# Altium schematic sheet CRAM_Mk1.SchDoc
size A3; SheetNumber: 1; SheetTotal: 2
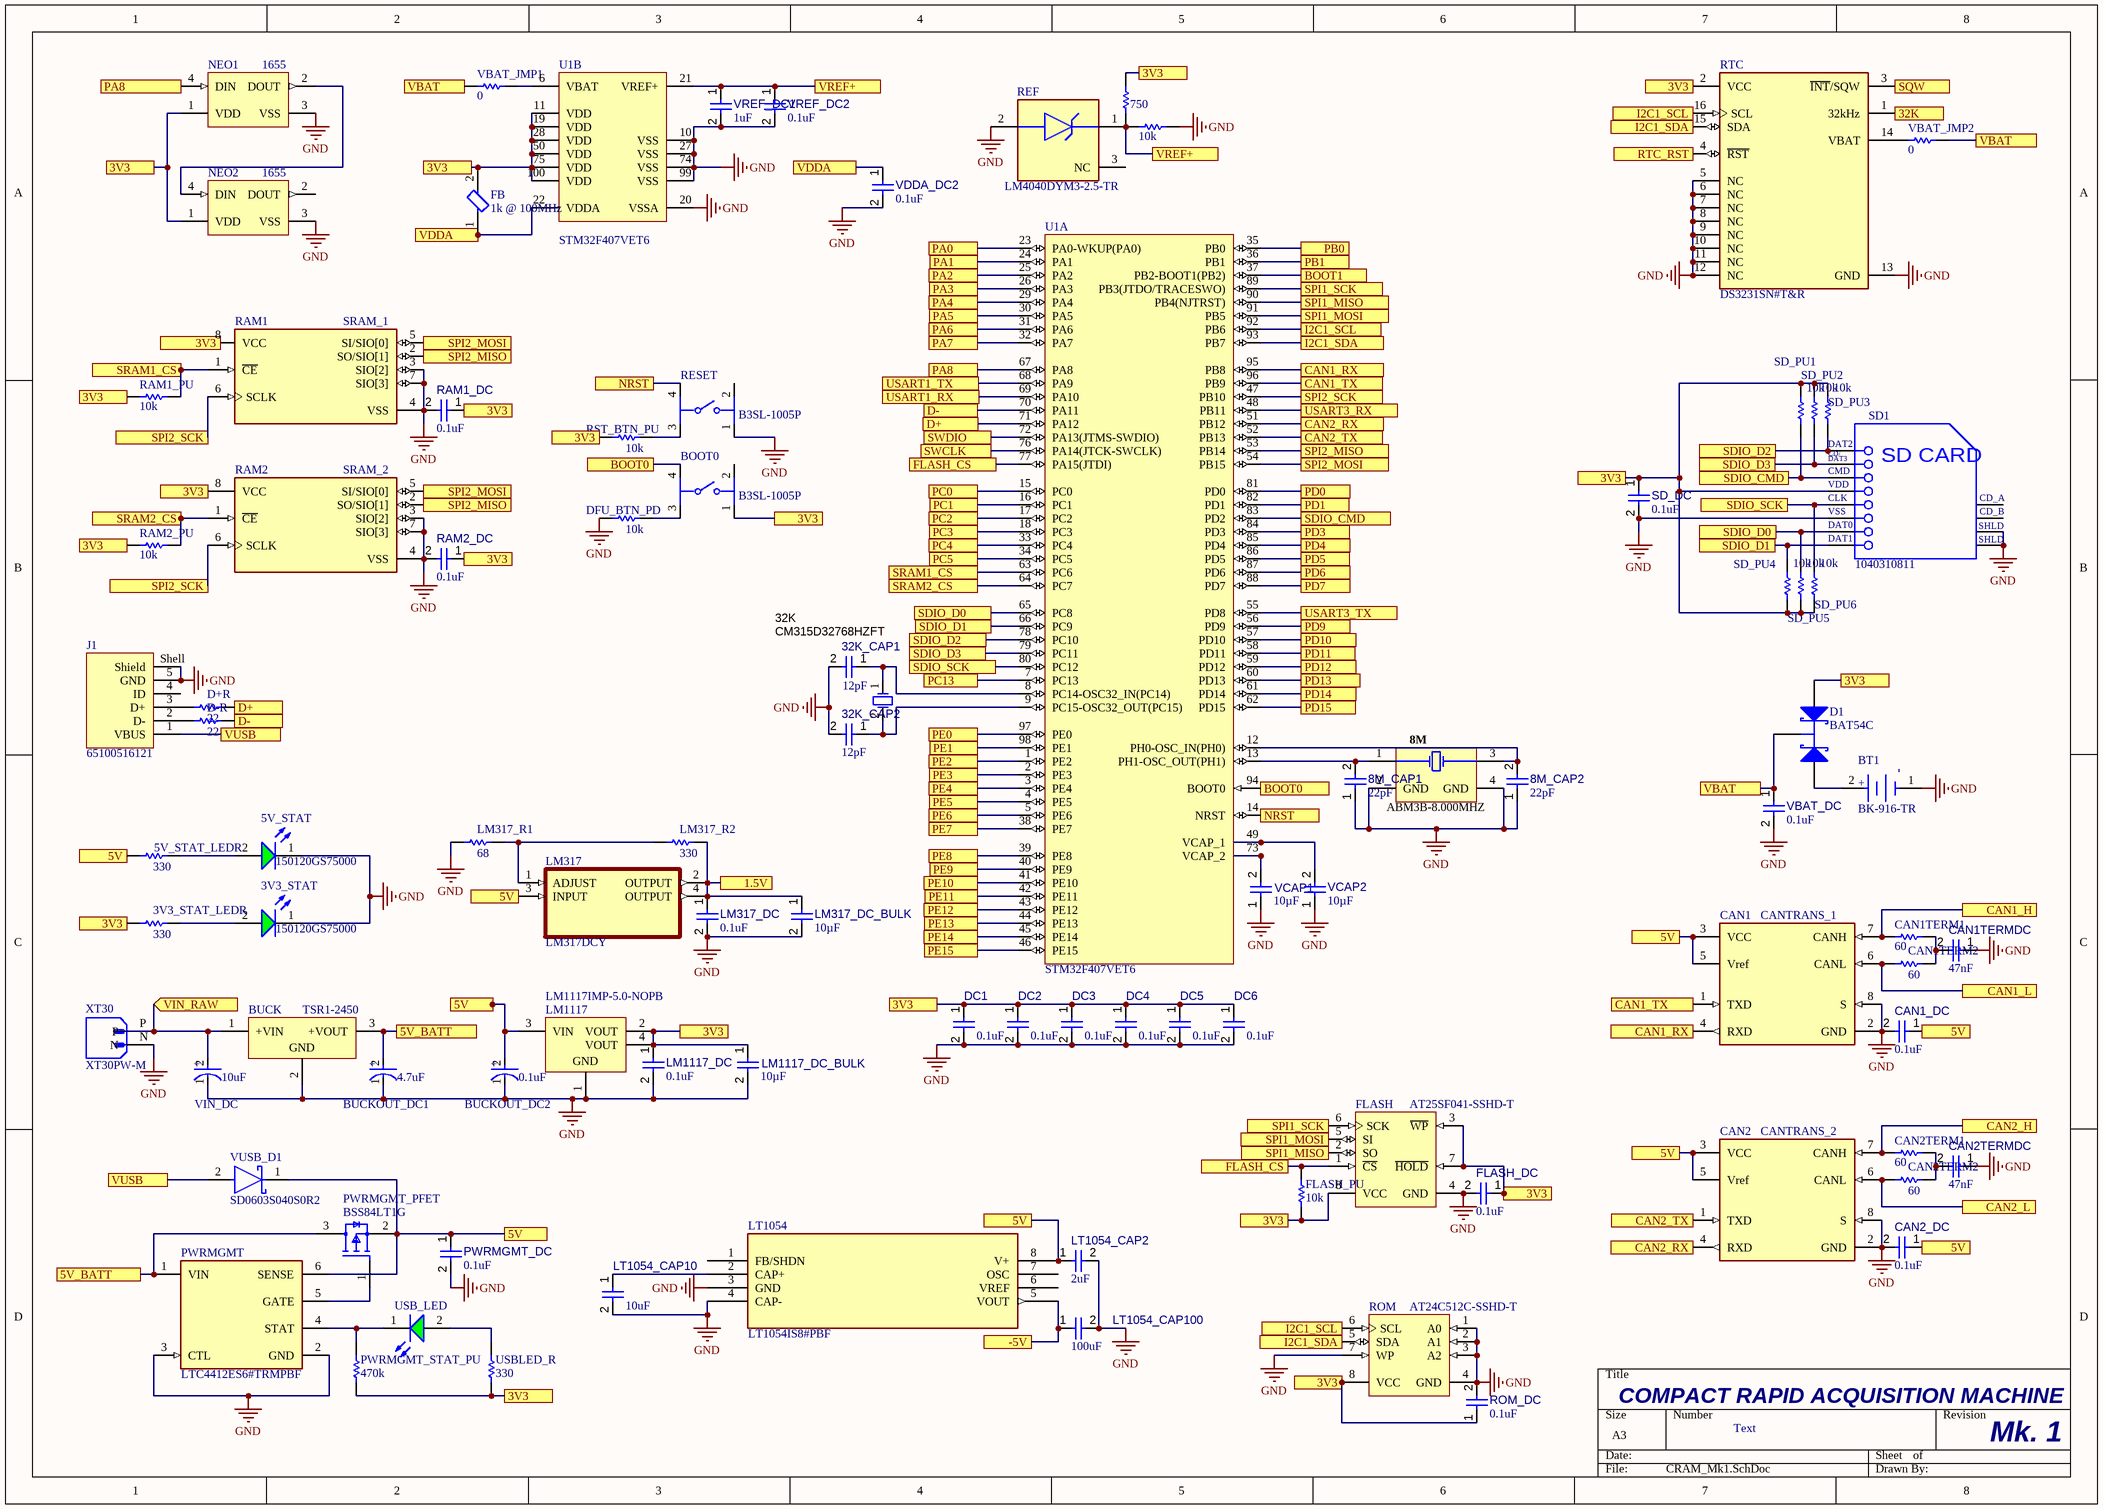
[diagram p0: CRAM_Mk1.SchDoc]

## Parts
3V3_STAT  150120GS75000  [WL-SMCW_1206_150120xx75000]
3V3_STAT_LEDR  value 330  [RESC1608X55X25ML10T15]  (hidden comment: Resistor 0R +/- 5% 0603 100 mW)
5V_STAT  150120GS75000  [WL-SMCW_1206_150120xx75000]
5V_STAT_LEDR  value 330  [RESC1608X55X25ML10T15]  (hidden comment: Resistor 0R +/- 5% 0603 100 mW)
8M  ABM3B-8.000MHZ  [ABRA-ABM3B_V]
8M_CAP1  value 22pF  [CAPC0603(1608)100_L]  (hidden comment: Capacitor 10µF +/-20% 10V 0603)
8M_CAP2  value 22pF  [CAPC0603(1608)100_L]  (hidden comment: Capacitor 10µF +/-20% 10V 0603)
32K  CM315D32768HZFT  [ABRA-ABS07-2_V]
32K_CAP1  value 12pF  [CAPC0603(1608)100_L]  (hidden comment: Capacitor 10µF +/-20% 10V 0603)
32K_CAP2  value 12pF  [CAPC0603(1608)100_L]  (hidden comment: Capacitor 10µF +/-20% 10V 0603)
BOOT0  B3SL-1005P  [FP-B3SL-1005P-MFG]
BT1  BK-916-TR  [FP-BK-916-TR-MFG]
BUCK  TSR1-2450  [TRACO-SIP-3_V]
BUCKOUT_DC1  4.7uF  [FP-FKC-MFG]
BUCKOUT_DC2  0.1uF  [FP-FKC-MFG]
CAN1  CANTRANS_1  [FP-SOT96-1-IPC_A]
CAN1_DC  value 0.1uF  [CAPC0603(1608)100_L]  (hidden comment: Capacitor 10µF +/-20% 10V 0603)
CAN1TERM1  value 60  [RESC1608X55X25ML10T15]  (hidden comment: Resistor 0R +/- 5% 0603 100 mW)
CAN1TERM2  value 60  [RESC1608X55X25ML10T15]  (hidden comment: Resistor 0R +/- 5% 0603 100 mW)
CAN1TERMDC  value 47nF  [CAPC0603(1608)100_L]  (hidden comment: Capacitor 10µF +/-20% 10V 0603)
CAN2  CANTRANS_2  [FP-SOT96-1-IPC_A]
CAN2_DC  value 0.1uF  [CAPC0603(1608)100_L]  (hidden comment: Capacitor 10µF +/-20% 10V 0603)
CAN2TERM1  value 60  [RESC1608X55X25ML10T15]  (hidden comment: Resistor 0R +/- 5% 0603 100 mW)
CAN2TERM2  value 60  [RESC1608X55X25ML10T15]  (hidden comment: Resistor 0R +/- 5% 0603 100 mW)
CAN2TERMDC  value 47nF  [CAPC0603(1608)100_L]  (hidden comment: Capacitor 10µF +/-20% 10V 0603)
D1  BAT54C  [NXP-SOT23-3_V]
D+R  value 22  [RESC1608X55X25ML10T15]  (hidden comment: Resistor 0R +/- 5% 0603 100 mW)
D-R  value 22  [RESC1608X55X25ML10T15]  (hidden comment: Resistor 0R +/- 5% 0603 100 mW)
DC1  value 0.1uF  [CAPC0603(1608)100_L]  (hidden comment: Capacitor 10µF +/-20% 10V 0603)
DC2  value 0.1uF  [CAPC0603(1608)100_L]  (hidden comment: Capacitor 10µF +/-20% 10V 0603)
DC3  value 0.1uF  [CAPC0603(1608)100_L]  (hidden comment: Capacitor 10µF +/-20% 10V 0603)
DC4  value 0.1uF  [CAPC0603(1608)100_L]  (hidden comment: Capacitor 10µF +/-20% 10V 0603)
DC5  value 0.1uF  [CAPC0603(1608)100_L]  (hidden comment: Capacitor 10µF +/-20% 10V 0603)
DC6  value 0.1uF  [CAPC0603(1608)100_L]  (hidden comment: Capacitor 10µF +/-20% 10V 0603)
DFU_BTN_PD  value 10k  [RESC1608X55X25ML10T15]  (hidden comment: Resistor 0R +/- 5% 0603 100 mW)
FB  1k @ 100MHz  [FP-MPZ1608-0_8-IPC_C]
FLASH  AT25SF041-SSHD-T  [ADST-SOIC-8_L]
FLASH_DC  value 0.1uF  [CAPC0603(1608)100_L]  (hidden comment: Capacitor 10µF +/-20% 10V 0603)
FLASH_PU  value 10k  [RESC1608X55X25ML10T15]  (hidden comment: Resistor 0R +/- 5% 0603 100 mW)
J1  65100516121  [65100516121]
LM317  LM317DCY  [SOT230P700X180-4N]
LM317_DC  value 0.1uF  [CAPC0603(1608)100_L]  (hidden comment: Capacitor 10µF +/-20% 10V 0603)
LM317_DC_BULK  value 10µF  [CAPC0603(1608)100_L]  (hidden comment: Capacitor 10µF +/-20% 10V 0603)
LM317_R1  value 68  [RESC2013X60X35ML10T20]  (hidden comment: Resistor 0R +/- 5% 0805 125 mW)
LM317_R2  value 330  [RESC2013X60X35ML10T20]  (hidden comment: Resistor 0R +/- 5% 0805 125 mW)
LM1117  LM1117IMP-5.0-NOPB  [DCY0004A_M]
LM1117_DC  value 0.1uF  [CAPC0603(1608)100_L]  (hidden comment: Capacitor 10µF +/-20% 10V 0603)
LM1117_DC_BULK  value 10µF  [CAPC0603(1608)100_L]  (hidden comment: Capacitor 10µF +/-20% 10V 0603)
LT1054  LT1054IS8#PBF  [SO-8_S]
LT1054_CAP2  value 2uF  [CAPC0603(1608)100_L]  (hidden comment: Capacitor 10µF +/-20% 10V 0603)
LT1054_CAP10  value 10uF  [CAPC0603(1608)100_L]  (hidden comment: Capacitor 10µF +/-20% 10V 0603)
LT1054_CAP100  value 100uF  [CAPC0603(1608)100_L]  (hidden comment: Capacitor 10µF +/-20% 10V 0603)
NEO1  1655  [ADA-RGB-1655_V]
NEO2  1655  [ADA-RGB-1655_V]
PWRMGMT  LTC4412ES6#TRMPBF  [FP-S6-6-05-08-1636-IPC_C]
PWRMGMT_DC  value 0.1uF  [CAPC0603(1608)100_L]  (hidden comment: Capacitor 10µF +/-20% 10V 0603)
PWRMGMT_PFET  BSS84LT1G  [FP-318-08-IPC_A]
PWRMGMT_STAT_PU  value 470k  [RESC1608X55X25ML10T15]  (hidden comment: Resistor 0R +/- 5% 0603 100 mW)
RAM1  SRAM_1  [FP-4677-IPC_C]
RAM1_DC  value 0.1uF  [CAPC0603(1608)100_L]  (hidden comment: Capacitor 10µF +/-20% 10V 0603)
RAM1_PU  value 10k  [RESC1608X55X25ML10T15]  (hidden comment: Resistor 0R +/- 5% 0603 100 mW)
RAM2  SRAM_2  [FP-4677-IPC_C]
RAM2_DC  value 0.1uF  [CAPC0603(1608)100_L]  (hidden comment: Capacitor 10µF +/-20% 10V 0603)
RAM2_PU  value 10k  [RESC1608X55X25ML10T15]  (hidden comment: Resistor 0R +/- 5% 0603 100 mW)
REF  LM4040DYM3-2.5-TR  [FP-SOT23-3LD-PL-1-MFG]
REF_BR1  value 750  [RESC1608X55X25ML10T15]  (hidden comment: Resistor 0R +/- 5% 0603 100 mW)
REF_BR2  value 10k  [RESC1608X55X25ML10T15]  (hidden comment: Resistor 0R +/- 5% 0603 100 mW)
RESET  B3SL-1005P  [FP-B3SL-1005P-MFG]
ROM  AT24C512C-SSHD-T  [ATML-8S1_L]
ROM_DC  value 0.1uF  [CAPC0603(1608)100_L]  (hidden comment: Capacitor 10µF +/-20% 10V 0603)
RST_BTN_PU  value 10k  [RESC1608X55X25ML10T15]  (hidden comment: Resistor 0R +/- 5% 0603 100 mW)
RTC  DS3231SN#T&R  [FP-W16-H2-MFG]
SD1  1040310811  [MOLX-104031-0811_V]
SD_DC  value 0.1uF  [CAPC0603(1608)100_L]  (hidden comment: Capacitor 10µF +/-20% 10V 0603)
SD_PU1  value 10k  [RESC1608X55X25ML10T15]  (hidden comment: Resistor 0R +/- 5% 0603 100 mW)
SD_PU2  value 10k  [RESC1608X55X25ML10T15]  (hidden comment: Resistor 0R +/- 5% 0603 100 mW)
SD_PU3  value 10k  [RESC1608X55X25ML10T15]  (hidden comment: Resistor 0R +/- 5% 0603 100 mW)
SD_PU4  value 10k  [RESC1608X55X25ML10T15]  (hidden comment: Resistor 0R +/- 5% 0603 100 mW)
SD_PU5  value 10k  [RESC1608X55X25ML10T15]  (hidden comment: Resistor 0R +/- 5% 0603 100 mW)
SD_PU6  value 10k  [RESC1608X55X25ML10T15]  (hidden comment: Resistor 0R +/- 5% 0603 100 mW)
U1  STM32F407VET6  [STM-LQFP100_L]  (parts A,B of 2)
USB_LED  150120GS75000  [WL-SMCW_1206_150120xx75000]  (value not drawn)
USBLED_R  value 330  [RESC1608X55X25ML10T15]  (hidden comment: Resistor 0R +/- 5% 0603 100 mW)
VBAT_DC  value 0.1uF  [CAPC0603(1608)100_L]  (hidden comment: Capacitor 10µF +/-20% 10V 0603)
VBAT_JMP1  value 0  [RESC1608X55X25ML10T15]  (hidden comment: Resistor 0R +/- 5% 0603 100 mW)
VBAT_JMP2  value 0  [RESC1608X55X25ML10T15]  (hidden comment: Resistor 0R +/- 5% 0603 100 mW)
VCAP1  value 10µF  [CAPC0603(1608)100_L]  (hidden comment: Capacitor 10µF +/-20% 10V 0603)
VCAP2  value 10µF  [CAPC0603(1608)100_L]  (hidden comment: Capacitor 10µF +/-20% 10V 0603)
VDDA_DC2  value 0.1uF  [CAPC0603(1608)100_L]  (hidden comment: Capacitor 10µF +/-20% 10V 0603)
VIN_DC  10uF  [FP-FKC-MFG]
VREF_DC1  value 1uF  [CAPC0603(1608)100_L]  (hidden comment: Capacitor 10µF +/-20% 10V 0603)
VREF_DC2  value 0.1uF  [CAPC0603(1608)100_L]  (hidden comment: Capacitor 10µF +/-20% 10V 0603)
VUSB_D1  SD0603S040S0R2  [FP-SD0603-MFG]
XT30  XT30PW-M  [AMASS_XT30PW-M]

## Ports
1.5V, 3V3, 5V, 5V_BATT, 32K, -5V, BOOT0, BOOT1, CAN1_H, CAN1_L, CAN1_RX, CAN1_TX, CAN2_H, CAN2_L, CAN2_RX, CAN2_TX, D+, D-, FLASH_CS, I2C1_SCL, I2C1_SDA, NRST, PA0, PA1, PA2, PA3, PA4, PA5, PA6, PA7, PA8, PB0, PB1, PC0, PC1, PC2, PC3, PC4, PC5, PC13, PD0, PD1, PD3, PD4, PD5, PD6, PD7, PD9, PD10, PD11, PD12, PD13, PD14, PD15, PE0, PE1, PE2, PE3, PE4, PE5, PE6, PE7, PE8, PE9, PE10, PE11, PE12, PE13, PE14, PE15, RTC_RST, SDIO_CMD, SDIO_D0, SDIO_D1, SDIO_D2, SDIO_D3, SDIO_SCK, SPI1_MISO, SPI1_MOSI, SPI1_SCK, SPI2_MISO, SPI2_MOSI, SPI2_SCK, SQW, SRAM1_CS, SRAM2_CS, SWCLK, SWDIO, USART1_RX, USART1_TX, USART3_RX, USART3_TX, VBAT, VDDA, VIN_RAW (in), VREF+, VUSB

## Nets
GND: 3V3_STAT.1(K) 5V_STAT.1(K) 8M.2(GND) 8M.4(GND) 8M_CAP1.1 8M_CAP2.1 32K_CAP1.2 32K_CAP2.2 BT1.1(C) BUCK.2(GND) BUCKOUT_DC1.1(C) BUCKOUT_DC2.1(C) CAN1.2(GND) CAN1.8(S) CAN1_DC.2 CAN1TERMDC.1 CAN2.2(GND) CAN2.8(S) CAN2_DC.2 CAN2TERMDC.1 DC1.2 DC2.2 DC3.2 DC4.2 DC5.2 DC6.2 DFU_BTN_PD.1 FLASH.4(GND) FLASH_DC.2 J1.5(GND) J1.Shell(Shield) LM317_DC.2 LM317_DC_BULK.2 LM317_R1.1 LM1117.1(GND) LM1117_DC.2 LM1117_DC_BULK.2 LT1054.3(GND) LT1054.4(CAP-) LT1054_CAP2.2 LT1054_CAP10.2 LT1054_CAP100.2 NEO1.3(VSS) NEO2.3(VSS) PWRMGMT.2(GND) PWRMGMT.3(CTL) PWRMGMT_DC.2 RAM1.3(SIO[2]) RAM1.4(VSS) RAM1.7(SIO[3]) RAM1_DC.2 RAM2.3(SIO[2]) RAM2.4(VSS) RAM2.7(SIO[3]) RAM2_DC.2 REF.2(-) REF_BR2.1 RESET.1 ROM.1(A0) ROM.2(A1) ROM.3(A2) ROM.4(GND) ROM.7(WP) ROM_DC.2 RTC.5(NC) RTC.6(NC) RTC.7(NC) RTC.8(NC) RTC.9(NC) RTC.10(NC) RTC.11(NC) RTC.12(NC) RTC.13(GND) SD1.6(VSS2) SD1.11(SHLD1) SD1.12(SHLD2) SD_DC.2 U1.10(VSS) U1.20(VSSA) U1.27(VSS) U1.74(VSS) U1.99(VSS) VBAT_DC.2 VCAP1.1 VCAP2.1 VDDA_DC2.2 VIN_DC.1(C) VREF_DC1.2 VREF_DC2.2 XT30.N
1.5V: LM317.2(OUTPUT) LM317.4(OUTPUT) LM317_DC.1 LM317_DC_BULK.1 LM317_R2.2 ; port 1.5V
3V3: 3V3_STAT_LEDR.1 BOOT0.1 D1.2(A) DC1.1 DC2.1 DC3.1 DC4.1 DC5.1 DC6.1 FB.2 FLASH.3(~{WP}) FLASH.7(~{HOLD}) FLASH.8(VCC) FLASH_DC.1 FLASH_PU.2 LM1117.2(VOUT) LM1117.4(VOUT) LM1117_DC.1 LM1117_DC_BULK.1 NEO1.1(VDD) NEO2.1(VDD) PWRMGMT_STAT_PU.2 RAM1_DC.1 RAM1_PU.1 RAM2.8(VCC) RAM2_DC.1 RAM2_PU.1 REF_BR1.1 ROM.8(VCC) ROM_DC.1 RST_BTN_PU.1 RTC.2(VCC) SD1.4(VDD) SD_DC.1 SD_PU1.2 SD_PU2.2 SD_PU3.2 SD_PU4.1 SD_PU5.1 SD_PU6.1 U1.11(VDD) U1.19(VDD) U1.28(VDD) U1.50(VDD) U1.75(VDD) U1.100(VDD) USBLED_R.2 ; port 3V3
5V: 5V_STAT_LEDR.1 BUCKOUT_DC2.2(A) CAN1.3(VCC) CAN1.5(Vref) CAN1_DC.1 CAN2.3(VCC) CAN2.5(Vref) CAN2_DC.1 LM317.3(INPUT) LM1117.3(VIN) LT1054.8(V+) LT1054_CAP2.1 PWRMGMT.6(SENSE) PWRMGMT_DC.1 PWRMGMT_PFET.2(S) VUSB_D1.1(C) ; port 5V
5V_BATT: BUCK.3(+VOUT) BUCKOUT_DC1.2(A) PWRMGMT.1(VIN) PWRMGMT_PFET.3(D) ; port 5V_BATT
32K: RTC.1(32kHz) ; port 32K
-5V: LT1054.5(VOUT) LT1054_CAP100.1 ; port -5V
BOOT0: BOOT0.4 U1.94(BOOT0) ; port BOOT0
BOOT1: U1.37(PB2-BOOT1(PB2)) ; port BOOT1
CAN1_H: CAN1.7(CANH) CAN1TERM1.2 ; port CAN1_H
CAN1_L: CAN1.6(CANL) CAN1TERM2.1 ; port CAN1_L
CAN1_RX: CAN1.4(RXD) U1.95(PB8) ; port CAN1_RX
CAN1_TX: CAN1.1(TXD) U1.96(PB9) ; port CAN1_TX
CAN2_H: CAN2.7(CANH) CAN2TERM1.2 ; port CAN2_H
CAN2_L: CAN2.6(CANL) CAN2TERM2.1 ; port CAN2_L
CAN2_RX: CAN2.4(RXD) U1.51(PB12) ; port CAN2_RX
CAN2_TX: CAN2.1(TXD) U1.52(PB13) ; port CAN2_TX
D+: D+R.2 U1.71(PA12) ; port D+
D-: D-R.2 U1.70(PA11) ; port D-
FLASH_CS: FLASH.1(~{CS}) FLASH_PU.1 U1.77(PA15(JTDI)) ; port FLASH_CS
I2C1_SCL: ROM.6(SCL) RTC.16(SCL) U1.92(PB6) ; port I2C1_SCL
I2C1_SDA: ROM.5(SDA) RTC.15(SDA) U1.93(PB7) ; port I2C1_SDA
NRST: RESET.4 U1.14(NRST) ; port NRST
PA0: U1.23(PA0-WKUP(PA0)) ; port PA0
PA1: U1.24(PA1) ; port PA1
PA2: U1.25(PA2) ; port PA2
PA3: U1.26(PA3) ; port PA3
PA4: U1.29(PA4) ; port PA4
PA5: U1.30(PA5) ; port PA5
PA6: U1.31(PA6) ; port PA6
PA7: U1.32(PA7) ; port PA7
PA8: NEO1.4(DIN) U1.67(PA8) ; port PA8
PB0: U1.35(PB0) ; port PB0
PB1: U1.36(PB1) ; port PB1
PC0: U1.15(PC0) ; port PC0
PC1: U1.16(PC1) ; port PC1
PC2: U1.17(PC2) ; port PC2
PC3: U1.18(PC3) ; port PC3
PC4: U1.33(PC4) ; port PC4
PC5: U1.34(PC5) ; port PC5
PC13: U1.7(PC13) ; port PC13
PD0: U1.81(PD0) ; port PD0
PD1: U1.82(PD1) ; port PD1
PD3: U1.84(PD3) ; port PD3
PD4: U1.85(PD4) ; port PD4
PD5: U1.86(PD5) ; port PD5
PD6: U1.87(PD6) ; port PD6
PD7: U1.88(PD7) ; port PD7
PD9: U1.56(PD9) ; port PD9
PD10: U1.57(PD10) ; port PD10
PD11: U1.58(PD11) ; port PD11
PD12: U1.59(PD12) ; port PD12
PD13: U1.60(PD13) ; port PD13
PD14: U1.61(PD14) ; port PD14
PD15: U1.62(PD15) ; port PD15
PE0: U1.97(PE0) ; port PE0
PE1: U1.98(PE1) ; port PE1
PE2: U1.1(PE2) ; port PE2
PE3: U1.2(PE3) ; port PE3
PE4: U1.3(PE4) ; port PE4
PE5: U1.4(PE5) ; port PE5
PE6: U1.5(PE6) ; port PE6
PE7: U1.38(PE7) ; port PE7
PE8: U1.39(PE8) ; port PE8
PE9: U1.40(PE9) ; port PE9
PE10: U1.41(PE10) ; port PE10
PE11: U1.42(PE11) ; port PE11
PE12: U1.43(PE12) ; port PE12
PE13: U1.44(PE13) ; port PE13
PE14: U1.45(PE14) ; port PE14
PE15: U1.46(PE15) ; port PE15
RTC_RST: RTC.4(~{RST}) ; port RTC_RST
SDIO_CMD: SD1.3(VSS1) SD_PU1.1 U1.83(PD2) ; port SDIO_CMD
SDIO_D0: SD1.7(DAT0) SD_PU5.2 U1.65(PC8) ; port SDIO_D0
SDIO_D1: SD1.8(DAT1) SD_PU4.2 U1.66(PC9) ; port SDIO_D1
SDIO_D2: SD1.1(CD/DAT3) SD_PU3.1 U1.78(PC10) ; port SDIO_D2
SDIO_D3: SD1.2(CMD) SD_PU2.1 U1.79(PC11) ; port SDIO_D3
SDIO_SCK: SD1.5(CLK) SD_PU6.2 U1.80(PC12) ; port SDIO_SCK
SPI1_MISO: FLASH.2(SO) U1.90(PB4(NJTRST)) ; port SPI1_MISO
SPI1_MOSI: FLASH.5(SI) U1.91(PB5) ; port SPI1_MOSI
SPI1_SCK: FLASH.6(SCK) U1.89(PB3(JTDO/TRACESWO)) ; port SPI1_SCK
SPI2_MISO: RAM1.2(SO/SIO[1]) RAM2.2(SO/SIO[1]) U1.53(PB14) ; port SPI2_MISO
SPI2_MOSI: RAM1.5(SI/SIO[0]) RAM2.5(SI/SIO[0]) U1.54(PB15) ; port SPI2_MOSI
SPI2_SCK: RAM1.6(SCLK) RAM2.6(SCLK) U1.47(PB10) ; port SPI2_SCK
SQW: RTC.3(~{INT}/SQW) ; port SQW
SRAM1_CS: RAM1.1(~{CE}) RAM1_PU.2 U1.63(PC6) ; port SRAM1_CS
SRAM2_CS: RAM2.1(~{CE}) RAM2_PU.2 U1.64(PC7) ; port SRAM2_CS
SWCLK: U1.76(PA14(JTCK-SWCLK)) ; port SWCLK
SWDIO: U1.72(PA13(JTMS-SWDIO)) ; port SWDIO
USART1_RX: U1.69(PA10) ; port USART1_RX
USART1_TX: U1.68(PA9) ; port USART1_TX
USART3_RX: U1.48(PB11) ; port USART3_RX
USART3_TX: U1.55(PD8) ; port USART3_TX
VBAT: D1.3(K) VBAT_DC.1 VBAT_JMP1.2 VBAT_JMP2.1 ; port VBAT
VDDA: FB.1 U1.22(VDDA) VDDA_DC2.1 ; port VDDA
VIN_RAW: BUCK.1(+VIN) VIN_DC.2(A) XT30.P ; port VIN_RAW
VREF+: REF.1(+) REF_BR1.2 REF_BR2.2 U1.21(VREF+) VREF_DC1.1 VREF_DC2.1 ; port VREF+
VUSB: J1.1(VBUS) VUSB_D1.2(A) ; port VUSB
Net3V3_STAT_2: 3V3_STAT.2(A) 3V3_STAT_LEDR.2
Net5V_STAT_2: 5V_STAT.2(A) 5V_STAT_LEDR.2
Net8M_1: 8M.1(X1) 8M_CAP1.2 U1.13(PH1-OSC_OUT(PH1))
Net8M_3: 8M.3(X2) 8M_CAP2.2 U1.12(PH0-OSC_IN(PH0))
Net32K_1: 32K.1(OSC1) 32K_CAP1.1 U1.8(PC14-OSC32_IN(PC14))
Net32K_2: 32K.2(OSC2) 32K_CAP2.1 U1.9(PC15-OSC32_OUT(PC15))
NetBOOT0_3: BOOT0.3 DFU_BTN_PD.2
NetBT1_2: BT1.2(A) D1.1(A)
NetCAN1TERM1_1: CAN1TERM1.1 CAN1TERM2.2 CAN1TERMDC.2
NetCAN2TERM1_1: CAN2TERM1.1 CAN2TERM2.2 CAN2TERMDC.2
NetD+R_1: D+R.1 J1.3(D+)
NetD-R_1: D-R.1 J1.2(D-)
NetLM317_1: LM317.1(ADJUST) LM317_R1.2 LM317_R2.1
NetLT1054_2: LT1054.2(CAP+) LT1054_CAP10.1
NetNEO1_2: NEO1.2(DOUT) NEO2.4(DIN)
NetPWRMGMT_4: PWRMGMT.4(STAT) PWRMGMT_STAT_PU.1 USB_LED.1(K)
NetPWRMGMT_5: PWRMGMT.5(GATE) PWRMGMT_PFET.1(G)
NetRESET_3: RESET.3 RST_BTN_PU.2
NetRTC_14: RTC.14(VBAT) VBAT_JMP2.2
NetU1_6: U1.6(VBAT) VBAT_JMP1.1
NetU1_49: U1.49(VCAP_1) VCAP2.2
NetU1_73: U1.73(VCAP_2) VCAP1.2
NetUSB_LED_2: USB_LED.2(A) USBLED_R.1

Not connected (* = marked no-connect by the designer): BOOT0 2; J1 4(ID); LT1054 1(FB/SHDN) 6(VREF) 7(OSC); NEO2 2(DOUT); RAM1 8(VCC); REF 3(NC); RESET 2; SD1 9(CD_A) 10(CD_B)

## Notes on the sheet
- COMPACT RAPID ACQUISITION MACHINE
- Text
- Mk. 1
- (in symbol CMP-002-00075-1) DAT2; CD/; DAT3; SD CARD; VSS; SHLD
- (in symbol CMP-05427-000030-1) +
- (in symbol CMP-136216-000004-1) -; +

## Library data of the parts
3V3_STAT 5V_STAT USB_LED = CMP-1426-00014-3: NexarPartId: 29717787; Peak Wavelength: 515nm; Wavelength: 520nm; Test Current: 20mA; Dominant Wavelength: 525nm; Luminous Intensity: 450mcd; Max Junction Temperature (Tj): 95°C; Power Dissipation: 105mW; Reverse Voltage: 5V; Forward Current: 100mA; Viewing Angle: 140°; Forward Voltage: 3.2V; Lens Style: Clear, Rectangular; Width: 1.6mm; Case Code (Metric): 3216; Mount: Surface Mount; Min Operating Temperature: -40°C; Packaging: Tape and Reel; Length: 3.2mm; REACH SVHC: Unknown; Max Reverse Voltage (DC): 5V; Case/Package: 1206; Height: 680µm; Case Code (Imperial): 1206; Color: Green; RoHS: Compliant; Max Operating Temperature: 85°C
3V3_STAT_LEDR 5V_STAT_LEDR CAN1TERM1 CAN1TERM2 CAN2TERM1 CAN2TERM2 D+R D-R DFU_BTN_PD FLASH_PU PWRMGMT_STAT_PU RAM1_PU RAM2_PU REF_BR1 REF_BR2 RST_BTN_PU SD_PU1-SD_PU6 USBLED_R VBAT_JMP1 VBAT_JMP2 = CMP-009-00006-5: Chip Resistor, 0 Ohm, 0.1 W, -55 to 155 degC, 0603 (1608 Metric); Voltage Rating: 50V; Power: 100mW; Max Operating Temperature: 155°C; RoHS Compliant: True; Tolerance: 5%; Pins: 2; Case/Package: 0603; Mounting Technology: SM; Min Operating Temperature: -55°C
8M = CMP-003-00021-2: Ceramic SMD Crystal, 8 MHz, +/- 20 ppm, 18 pF, -20 to 70 degC, 4-Pin SMD, RoHS, Tape and Reel; Manufacturer: Abracon; Resistance: 200Ohm; ESR: 200; Tolerance: 20ppm; Frequency: 8MHz; Load Capacitance: 18pF; Mounting Technology: SM; Case/Package: CSMD; Pins: 4; Datasheet Version: Aug-15; Datasheet URL: http://www.abracon.com/Resonators/abm3b.pdf; Manufacturer URL: http://www.abracon.com/; Package Quantity: 1000; Package Description: 4-Pin Surface Mount Device, Body 5 x 3.2 mm; Package Reference: ABM3B; Min Operating Temperature: -20°C; Max Operating Temperature: 70°C; Packaging: TapeandReel; Frequency Tolerance: 20ppm; RoHS Compliant: True
8M_CAP1 8M_CAP2 32K_CAP1 32K_CAP2 CAN1_DC CAN1TERMDC CAN2_DC CAN2TERMDC DC1-DC6 FLASH_DC LM317_DC LM317_DC_BULK LM1117_DC LM1117_DC_BULK LT1054_CAP2 LT1054_CAP10 LT1054_CAP100 PWRMGMT_DC RAM1_DC RAM2_DC ROM_DC SD_DC VBAT_DC VCAP1 VCAP2 VDDA_DC2 VREF_DC1 VREF_DC2 = CMP-001-00075-4: Chip Capacitor, 10µF +/-20%, 10V, 0603, Thickness 1 mm; Tolerance: 10%; Voltage Rating: 10V; Max Operating Temperature: 85°C; Pins: 2; Case/Package: 0603; Mounting Technology: SMT; Min Operating Temperature: -55°C
32K = CMP-003-00022-2: 32.768 kHz ±5ppm Crystal 12.5pF 70 kOhms 2-SMD, No Lead; Manufacturer: Abracon; Frequency Tolerance: 20ppm; ESR: 70k; Max Operating Temperature: 85°C; Mounting Technology: SM; Manufacturer URL: http://www.abracon.com/; Pins: 2; Packaging: TapeandReel; Tolerance: 20ppm; Min Operating Temperature: -40°C; Frequency: 32.768kHz; Datasheet URL: http://www.abracon.com/Resonators/ABS07.pdf; RoHS Compliant: True; Package Description: 2-Pin Surface Mount Device, Body 3.2 x 1.5 mm; Datasheet Version: Aug-15; Package Reference: ABS07-2; Package URL: http://www.abracon.com/Support/PackageDrawing/Resonators/ABS07.PDF; Load Capacitance: 12.5pF; Package Quantity: 3000; Case/Package: CSMD
BOOT0 RESET = CMP-08834-000035-1: SWITCH TACTILE SPST-NO 0.05A 12V; Actuator Material: Rubber; Actuator Length: 0.9mm; Connector Type: SMD/SMT; Switch Travel: 0.6mm; Actuator Color: Blue; Contact Resistance: 100mR; Illumination Type: Non-Illuminated; Operating Force: 3.5N; Actuator Type: Standard; Switch Function: Off-Mom; Current Rating: 50mA; Ratings: IP67; Throw Configuration: SPST; Mechanical Life: 100000Cycles; Package Quantity: 1; Max Voltage Rating (DC): 12V; Contact Material: Silver; Case/Package: SMD/SMT; Orientation: Straight; Contact Plating: Silver; Packaging: Tape and Reel; Width: 6.5mm; Max Operating Temperature: 90°C; Length: 6.2mm; Voltage Rating (DC): 12V; Mount: Surface Mount; Height: 3.4mm; Termination: SMD/SMT; Radiation Hardening: No; Min Operating Temperature: -25°C; Series: B3SL
BT1 = CMP-136216-000004-1: BATTERY RETAINER COIN 12MM SMD; Number of Cells: 1; Termination: SMD/SMT; Mount: Surface Mount
BUCK = CMP-002-00077-1: DC-DC Regulated Power Supply Module, 1 Output, 5W, Hybrid; Pins: 3; Max Operating Temperature: 60°C; RoHS Compliant: Yes; Min Operating Temperature: -40°C
BUCKOUT_DC1 BUCKOUT_DC2 VIN_DC = CMP-05427-000030-1: CAP ALUM 10UF 20% 50V SMD; Impedance: 1.52R; Ripple Current (AC): 85mA; Life (Hours): 2000Hour; Leakage Current: 3uA; Dielectric Material: Aluminium; Length: 5.8mm; Voltage Rating: 50V; Radiation Hardening: No; Max Operating Temperature: 105°C; REACH SVHC: No SVHC; Tolerance: 20%; RoHS Compliant: Yes; Case/Package: Radial; Height: 5.8mm; Voltage: 50V; Diameter: 5mm; Number of Pins: 2; Ripple Current: 85mA; Series: FK; Lead Free: Lead Free; Width: 6.5mm; ESR (Equivalent Series Resistance): 1.52R; Package Quantity: 1000; Construction: Cylindrical; Voltage Rating (DC): 50V; Packaging: Tape and Reel; Height - Seated (Max): 0.228inch; Contact Plating: Tin; Capacitance: 10uF; Min Operating Temperature: -55°C; Termination: SMD/SMT; Material: Aluminium; Mount: Surface Mount
CAN1 CAN2 = CMP-2000-04923-2: IC TRANSCEIVER HALF 1/1 8SO; Simplex/Duplex: Half Duplex; Max Supply Current: 10mA; Number of Receive Buffers: 1; Min Supply Voltage: 4.75V; Max Supply Voltage: 5.25V; Interface: CAN; Data Rate: 1Mbps; Receiver Hysteresis: 70mV; Number of Transmit Buffers: 1; Min Operating Temperature: -40°C; Case/Package: SO; REACH SVHC: No SVHC; Max Operating Temperature: 150°C; Number of Pins: 8; Lead Free: Lead Free; Number of Transceivers: 1; Packaging: Tape and Reel; Mount: Surface Mount; Radiation Hardening: No; Nominal Supply Current: 10mA; Package Quantity: 2500; Contact Plating: Gold
D1 = CMP-0417-00003-1: Schottky Barrier Diode, 30 V, 2 uA, -55 to 150 degC, 3-Pin SOT23, RoHS, Tape and Reel; Manufacturer: NXP Semiconductors; IR (uA): 2; VF (mV): 800; Trr (ns): 5; Cd (pF): 10; VR (V): 30; Rth(j-a) (K/W): 500; RoHS: TRUE; Packing: Tape and Reel; ComponentLink2URL: http://www.nxp.com/documents/data_sheet/BAT54_SER.pdf; PartNumber: BAT54C; ComponentLink2Description: Datasheet; Temperature Range: -55 to 150 degC; PackageReference: SOT23-3; PackageDescription: 3-Pin Plastic Surface-mounted Package, Body 1.3 x 2.9 mm, Pitch 0.95 mm; Mounting Technology: Surface Mount; ComponentLink1URL: http://www.nxp.com/; DatasheetVersion: Rev. 5; ComponentLink1Description: Manufacturer URL
FB = CMP-08257-000448-1: Power line Ferrite Bead 390Ω @ 100MHz 1.2A DCR 0.12Ω SMD 0603; Tolerance: 25%; DC Resistance (DCR): 120mR; Impedance: 390R; Current Rating: 1.2A; RoHS Compliant: Yes; Lead Free: Lead Free; Number of Pins: 2; Case/Package: 0603; Mount: Surface Mount; Packaging: Tape and Reel; Case Code (Imperial): 0603; Core Material: Ferrite; Width: 0.031inch; Length: 0.063inch; Package Quantity: 4000; Height: 0.037inch; Case Code (Metric): 1608; Max DC Current: 1.2A; REACH SVHC: No SVHC; Series: MPZ
FLASH = CMP-2000-07560-1: SPI Serial Flash Memory with Dual-I/O and Quad-I/O Support, 4 Mbits, 2.5 to 3.6 V, -40 to 85 degC, 8-Pin SOIC, RoHS, Tape and Reel; Manufacturer: Adesto; Frequency: 104MHz; Access Time: 8ns; Data Bus Width: 8b; Min Supply Voltage: 2.5V; Operating Supply Voltage: 3.3V; Package Version: Rev. G, 08/2014; Density: 4Mb; Page Size: 256B; Max Supply Voltage: 3.6V; Max Supply Current: 8mA; Number of Pins: 8; Memory Type: FLASH; Manufacturer URL: http://www.adestotech.com/; Max Frequency: 104MHz; Interface: Serial; Package Quantity: 4000; Weight: 0.019048oz; Mounting Technology: SurfaceMount; Min Operating Temperature: -40degC; Package Reference: SOIC-8; Max Operating Temperature: 85degC; Lead Free: LeadFree; Mount: SurfaceMount; Contact Plating: Gold; RoHSCompliant: True; Package Description: 8-Pin Small Outline Integrated Circuit, Body 4.925 x 3.9 mm, Pitch 1.27 mm; Case\/Package: SOIC; Datasheet URL: http://www.adestotech.com/wp-content/uploads/DS-AT25SF041_044.pdf; Datasheet Version: Rev. G, 08/2017; Memory Size: 4Mb; Packaging: TapeandReel
J1 = CMP-2000-05576-3: NexarPartId: 21041531; USB Standard: USB 2.0; Number of Positions: 5; Voltage Rating (DC): 30V; Number of Ports: 1; Gender: Receptacle; Current Rating: 1A; Connector Type: Socket, USB; Contact Resistance: 20mΩ; Insulation Resistance: 1GΩ; Contact Plating: Gold; Color: Black; Lead Free: Lead Free; Orientation: Horizontal; Number of Contacts: 5; REACH SVHC: Unknown; Packaging: Tape and Reel; Length: 7.7mm; Mount: Horizontal, Surface Mount; Height: 4.05mm; Max Operating Temperature: 105°C; Voltage Rating: 30V; Flammability Rating: UL94 V-0; Contact Material: Gold; Operating Supply Voltage: 30V; RoHS: Compliant; Width: 9.25mm; Number of Pins: 5; Min Operating Temperature: -40°C; Termination: Solder; Working Voltage: 30V
LM317 = LM317DCY: MF: {'manufacturer': u'Texas Instruments'}; Package: None; Price: None; Value: *; MP: LM317DCY; Availability: Unavailable
LM317_R1 LM317_R2 = CMP-009-00007-5: Chip Resistor, 0 Ohm, 0.125 W, -55 to 155 degC, 0805 (2012 Metric); Voltage Rating: 50V; Power: 125mW; Max Operating Temperature: 155°C; RoHS Compliant: True; Tolerance: 5%; Pins: 2; Case/Package: 0805; Mounting Technology: SM; Min Operating Temperature: -55°C
LM1117 = CMP-019-00021-3: Low-Dropout Linear Regulator, 800 mA, -40 to 125 degC, 4-Pin SOT-223 (DCY), Green (RoHS & no Sb/Br), Tape and Reel; Manufacturer: Texas Instruments; Dropout Voltage: 1.2V; Nominal Output Voltage: 5V; Max Ouput Current: 800mA; Outputs: 1; Min Input Voltage: 2.6V; Max Input Voltage: 15V; Manufacturer URL: http://www.ti.com/; Max Operating Temperature: 125°C; Packaging: TapeandReel; RoHS Compliant: True; Output Voltage: 5V; Pins: 4; Package Description: 4-Pin Small Outline Transistor, Body 6.5 x 3.5 mm, Pitch 2.3 mm; Min Operating Temperature: -40°C; Mounting Technology: SM; Output Current: 800mA; Case/Package: SOT-223; Datasheet Version: SNOS412N, 01/2016; Datasheet URL: http://www.ti.com/lit/ds/symlink/lm1117.pdf; Package Reference: DCY0004A
LT1054 = LT1054IS8#PBF: MF: {'manufacturer': u'Analog Devices'}; Package: None; Price: None; Value: *; MP: LT1054IS8#PBF; Availability: Unavailable
NEO1 NEO2 = CMP-2000-05026-1: Intelligent Control LED Integrated Light Source, 3.5 to 5.3 V, -25 to 80 degC, 4-Pin SMD, RoHS, Tape and Reel; Manufacturer: Adafruit-Industries-LLC; Number of LEDs: 10; Configuration: Discrete; Utilized LED: WS2812(5050); Datasheet URL: http://datasheet.octopart.com/ADA1655-Adafruit-Industries-datasheet-32028139.pdf; Series: Neopixel; Interface: -; Package Description: 4-Pin Surface Mount Device, Body 5 x 5 mm; Color: Red,Green,Blue(RGB); Category: Optoelectronics; Controller Type: -; Package Reference: 1655; Manufacturer URL: https://www.adafruit.com/; Mounting Type: SurfaceMount; Datasheet Version: May-13; Size / Dimension: 5.00mmLx5.00mmW; Family: Addressable,Specialty
PWRMGMT = CMP-0479-00425-2: IC OR CTRLR SRC SELECT TSOT23-6; Min Supply Voltage: 2.5V; Max Supply Voltage: 28V; Turn-On Delay Time: 110us; Number of Channels: 1; Lead Free: Lead Free; Length: 2.9mm; Radiation Hardening: No; RoHS Compliant: Yes; Package Quantity: 1; Min Operating Temperature: -40°C; Series: PowerPath™; Packaging: Tape and Reel; Width: 1.75mm; Height: 0.9mm; Number of Pins: 6; Max Operating Temperature: 85°C; Number of Outputs: 1; Case/Package: TSOT; REACH SVHC: No SVHC
PWRMGMT_PFET = CMP-1058-00762-2: MOSFET P-CH 50V 130MA SOT-23; Max Power Dissipation: 225mW; On-State Resistance: 10R; Nominal Vgs: 2V; Gate to Source Voltage (Vgs): 20V; Rise Time: 1ns; Turn-Off Delay Time: 16ns; Voltage Rating (DC): -50V; Turn-On Delay Time: 3.6ns; Number of Elements: 1; Current Rating: -130mA; Input Capacitance: 30pF; Threshold Voltage: -2V; Element Configuration: Single; Drain to Source Breakdown Voltage: 50V; Continuous Drain Current (ID): 130mA; Length: 0.119inch; Drain to Source Voltage (Vdss): 50V; Min Operating Temperature: -55°C; Contact Plating: Tin; Lead Free: Lead Free; Width: 0.055inch; Case/Package: SOT-23-3; Max Operating Temperature: 150°C; Halogen Free: Halogen Free; Radiation Hardening: No; Drain to Source Resistance: 10R; REACH SVHC: No SVHC; Power Dissipation: 225mW; Number of Pins: 3; Package Quantity: 1; Packaging: Tape and Reel; Fall Time: 1ns; Rds On Max: 10R; Height: 0.04inch
RAM1 RAM2 = CMP-144198-000001-1: IC PSRAM 64MBIT SPI 133MHZ 8SOIC
REF = CMP-06323-000001-1: IC VREF SHUNT 1% SOT23-3; Manufacturer: Microchip; Nominal Supply Current: 45uA; Max Power Dissipation: 306mW; Standoff Height: 0.013mm; Output Type: Fixed; Output Voltage: 2.5V; Number Of Outputs: 1; ComponentLink2Description: Datasheet; Package: SOT23-3LD-PL-1; ComponentLink2URL: http://ww1.microchip.com/downloads/en/DeviceDoc/LM4040-41-Precision-Micropower-Shunt-Voltage-Reference-DS20005757B.pdf; Device Class L3: Voltage References; Device Class L2: Power Management ICs; Temperature Range High: +85°C; Ambient Temperature Range Low: -40°C; RoHS: TRUE; Octopart: https://octopart.com/lm4040dym3-2.5-tr-microchip-66800126; Height: 1.11mm; Category: IC; Manufacturer Part Number: LM4040DYM3-2.5-TR; Temperature Range Low: -40°C; Temperature: -40°C to +85°C; Reference Type: Shunt; Digikey Description: IC VREF SHUNT 1% SOT23-3; Lead Free: Yes; Automotive: No; Device Class L1: Integrated Circuits (ICs); Mouser Description: LM4040 Series 2.5 V ±1 % Precision Micropower Shunt Voltage Reference - SOT-23; Ambient Temperature Range High: +85°C
ROM = CMP-2000-05801-1: 512-Kbit (65,536 x 8), 2-Wire Bus Serial EEPROM with Write Protect, 2.5 to 5.5 V, -40 to 85 degC, 8-Pin SOIC (8S1), RoHS, Tape and Reel; Manufacturer: Atmel; Data Retention: 40Year; Maximum Random Access Time: 550ns; Maximum Operating Frequency: 1MHz; Typical Operating Supply Voltage: 3.3; Organization: 64Kx8; Hardware Data Protection: Yes; Interface Type: Serial(2-Wire); Density: 512Kb; Operating Temperature: -40to85°C; Package Reference: 8S1; Datasheet URL: http://www.atmel.com/Images/Atmel-8720-SEEPROM-AT24C512C-Datasheet.pdf; Package Description: 8-Pin Small Outline Integrated Circuit, Body 4.925 x 3.9 mm, Pitch 1.27 mm; Mounting Technology: SurfaceMount; Manufacturer URL: http://www.atmel.com/; Category: EEPROM; Package: 8SOIC; Datasheet Version: Rev. 8720G, 09/2015
RTC = CMP-0254-00375-2: IC RTC CLK/CALENDAR I2C 16-SOIC; Operating Supply Voltage: 3.3V; Max Supply Voltage: 5.5V; Logic Function: Clock; Time Format: HH:MM:SS; Date Format: YY-MM-DD-dd; Min Supply Voltage: 2.3V; Min Operating Temperature: -40°C; Packaging: Tape and Reel; Radiation Hardening: No; Package Quantity: 1000; Case/Package: SOIC; Max Operating Temperature: 85°C; Lead Free: Lead Free; Interface: I2C; Contact Plating: Tin; Number of Pins: 16; Mount: Surface Mount
SD1 = CMP-002-00075-1: 1.10mm Pitch microSD Memory Card Connector, Surface Mount, Push-Pull Type, 1.42mm Height, with Detect Switch
U1 = CMP-020-00023-1: RISC Microcontroller, 32-Bit, FLASH, CORTEX-M4 CPU, 168MHz, CMOS, PQFP100; Nominal Supply Voltage: 3.3V; Max Supply Voltage: 3.6V; Min Supply Voltage: 1.8V; RoHS Compliant: Yes; Case/Package: LFQFP; Min Operating Temperature: -40°C; Max Operating Temperature: 85°C; Pins: 100; Clock Frequency: 168MHz
VUSB_D1 = CMP-04549-000001-1: DIODE SCHOTTKY 40V 200MA 0603; Manufacturer: AVX; Max Surge Forward Current: 2A; Forward Current: 0.2A; Lead Free: Yes; Reverse Voltage: 40V; Temperature Range Low: -55°C; Device Class L1: Discrete Semiconductors; Category: Diode; ComponentLink2URL: http://datasheets.avx.com/schottky.pdf; Device Class L3: Schottky Diodes; Automotive: No; Temperature Range High: +125°C; Digikey Description: DIODE SCHOTTKY 40V 200MA 0603; Device Class L2: Diodes; ComponentLink2Description: Datasheet; Max Repetitive Reverse Voltage: 40V; Mouser Description: Schottky Diodes & Rectifiers 40volts 0.2A SIZE 0603; Height: 0.86mm; Temperature: -55°C to +125°C; Manufacturer Part Number: SD0603S040S0R2; Package: SD0603; RoHS: TRUE; Octopart: https://octopart.com/sd0603s040s0r2-avx-24931763
XT30 = XT30PW-M: MF: {'manufacturer': u'AMASS'}; Package: None; Price: None; Value: *; MP: XT30PW-M; Availability: Unavailable